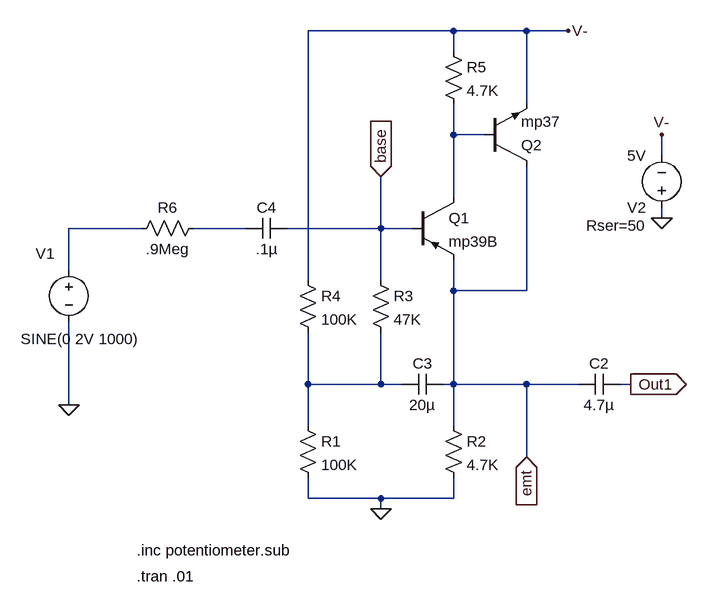
[diagram p0: schematic bootstrapped-buffer-mp39b-complementary.asc]
bootstrapped-buffer-mp39b-complementary.asc, the LTspice schematic file:
Version 4
SHEET 1 880 680
WIRE -960 -992 -1184 -992
WIRE -848 -992 -960 -992
WIRE -784 -992 -848 -992
WIRE -960 -960 -960 -992
WIRE -848 -880 -848 -992
WIRE -960 -832 -960 -880
WIRE -912 -832 -960 -832
WIRE -640 -800 -640 -832
WIRE -960 -736 -960 -832
WIRE -640 -704 -640 -720
WIRE -1440 -688 -1552 -688
WIRE -1280 -688 -1360 -688
WIRE -1072 -688 -1072 -768
WIRE -1072 -688 -1216 -688
WIRE -1024 -688 -1072 -688
WIRE -1552 -624 -1552 -688
WIRE -1184 -608 -1184 -992
WIRE -1072 -608 -1072 -688
WIRE -960 -592 -960 -640
WIRE -848 -592 -848 -784
WIRE -848 -592 -960 -592
WIRE -1184 -448 -1184 -528
WIRE -1072 -448 -1072 -528
WIRE -1072 -448 -1184 -448
WIRE -1040 -448 -1072 -448
WIRE -960 -448 -960 -592
WIRE -960 -448 -976 -448
WIRE -848 -448 -960 -448
WIRE -768 -448 -848 -448
WIRE -688 -448 -704 -448
WIRE -1552 -416 -1552 -544
WIRE -1184 -384 -1184 -448
WIRE -960 -384 -960 -448
WIRE -848 -336 -848 -448
WIRE -1184 -272 -1184 -304
WIRE -1072 -272 -1184 -272
WIRE -960 -272 -960 -304
WIRE -960 -272 -1072 -272
WIRE -1072 -256 -1072 -272
FLAG -1552 -416 0
FLAG -640 -704 0
FLAG -640 -832 V-
FLAG -1072 -256 0
FLAG -784 -992 V-
FLAG -688 -448 Out1
IOPIN -688 -448 Out
FLAG -1072 -768 base
IOPIN -1072 -768 In
FLAG -848 -336 emt
IOPIN -848 -336 In
SYMBOL voltage -1552 -640 R0
WINDOW 39 -112 95 Left 2
WINDOW 3 -74 122 Left 2
WINDOW 0 -51 -9 Left 2
SYMATTR Value SINE(0 2V 1000)
SYMATTR InstName V1
SYMATTR Value2 AC 1
SYMBOL voltage -640 -704 R180
WINDOW 123 0 0 Left 2
WINDOW 39 24 -12 Left 2
SYMATTR SpiceLine Rser=50
SYMATTR InstName V2
SYMATTR Value 5V
SYMBOL pnp -1024 -736 R0
SYMATTR InstName Q1
SYMATTR Value mp39B
SYMBOL res -1200 -400 R0
SYMATTR InstName R1
SYMATTR Value 100K
SYMBOL cap -704 -464 R90
WINDOW 0 0 32 VBottom 2
WINDOW 3 32 32 VTop 2
SYMATTR InstName C2
SYMATTR Value 4.7µ
SYMBOL res -976 -400 R0
SYMATTR InstName R2
SYMATTR Value 4.7K
SYMBOL cap -976 -464 R90
WINDOW 0 0 32 VBottom 2
WINDOW 3 32 32 VTop 2
SYMATTR InstName C3
SYMATTR Value 20µ
SYMBOL res -1088 -624 R0
SYMATTR InstName R3
SYMATTR Value 47K
SYMBOL res -1200 -624 R0
SYMATTR InstName R4
SYMATTR Value 100K
SYMBOL cap -1216 -704 R90
WINDOW 0 0 32 VBottom 2
WINDOW 3 32 32 VTop 2
SYMATTR InstName C4
SYMATTR Value .1µ
SYMBOL res -1344 -704 R90
WINDOW 0 0 56 VBottom 2
WINDOW 3 32 56 VTop 2
SYMATTR InstName R6
SYMATTR Value .9Meg
SYMBOL npn -912 -784 M180
SYMATTR InstName Q2
SYMATTR Value mp37
SYMBOL res -976 -976 R0
SYMATTR InstName R5
SYMATTR Value 4.7K
TEXT -1448 -152 Left 2 !.tran .01
TEXT -1448 -192 Left 2 !.inc potentiometer.sub

The netlist it stands for:
* bootstrapped-buffer-mp39b-complementary.asc
V1 N002 0 SINE(0 2V 1000) AC 1
V2 0 V- 5V Rser=50
Q1 N001 base emt 0 mp39B
R1 N004 0 100K
C2 Out1 emt 4.7µ
R2 emt 0 4.7K
C3 emt N004 20µ
R3 base N004 47K
R4 V- N004 100K
C4 base N003 .1µ
R6 N003 N002 .9Meg
Q2 emt N001 V- 0 mp37
R5 V- N001 4.7K
.model NPN NPN
.model PNP PNP
.lib standard.bjt
.tran .01
.inc potentiometer.sub
.backanno
.end